# Altium schematic sheet P02_Photon.SchDoc
size 246 x 182 mm
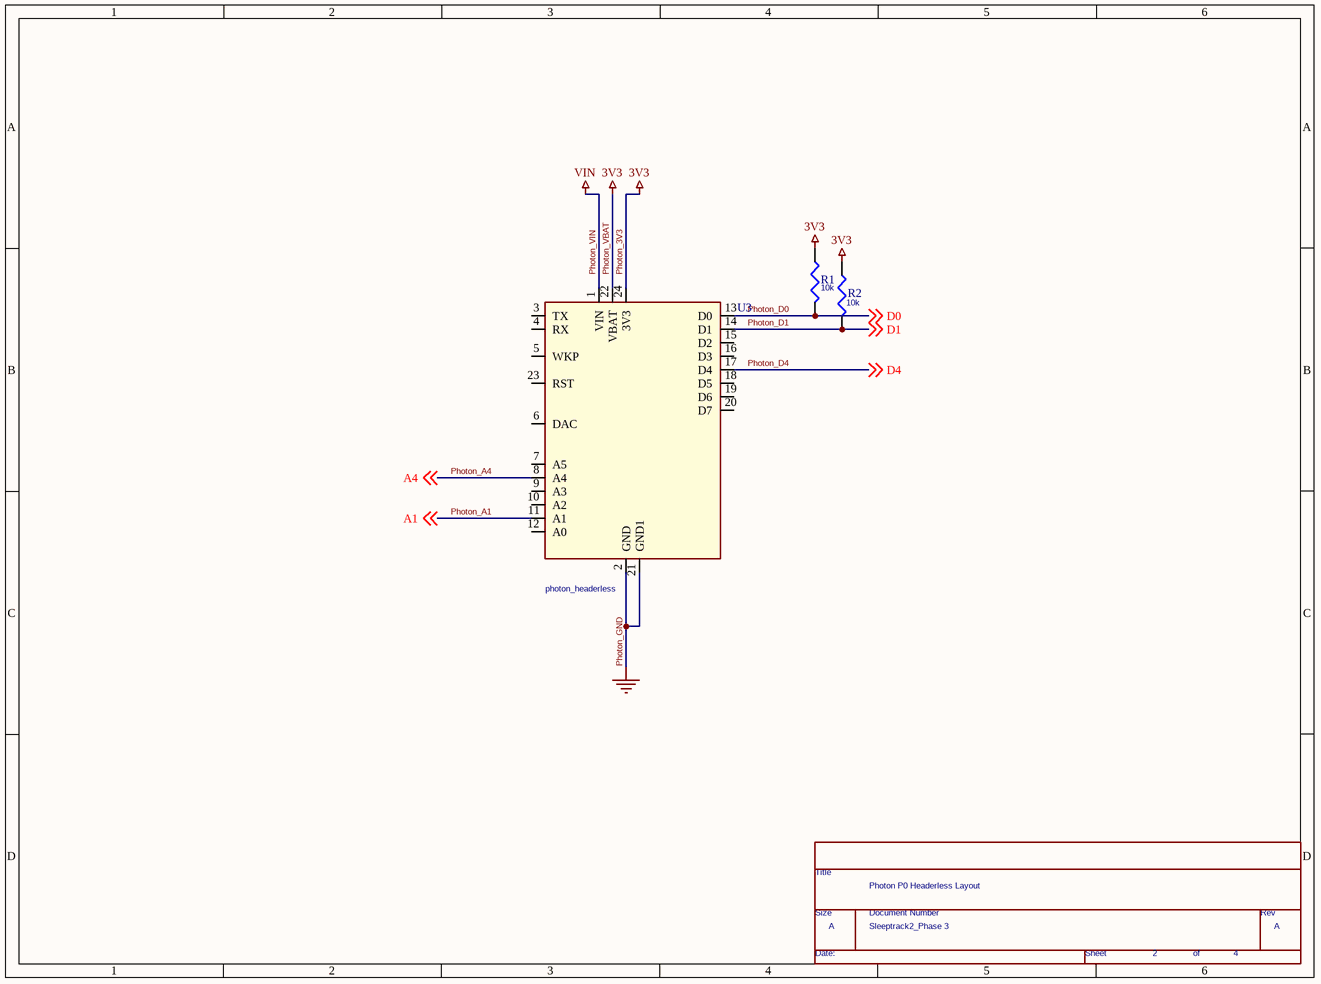
[diagram p0: P02_Photon.SchDoc]

## Parts
*  Doc: Sleeptrack2_Phase 3  RevCode: A  Title: Photon P0 Headerless Layout  Page Number: 2  Page Count: 4  (hidden comment: TitleBlock0)  (graphical)
R1  10k  [RESC402N]
R2  10k  [RESC402N]
U3  photon_headerless  [Photon P0 - duplicate]

## Nets
Photon_3V3: R1.1 R2.1 U3.22(VBAT) U3.24(3V3)  [also labelled 3V3, Photon_VBAT]
Photon_GND: U3.2(GND) U3.21(GND1)  [also labelled GND]
Photon_VIN: U3.1(VIN)  [also labelled VIN]
Photon_A1: U3.11(A1) ; off-sheet A1  [also labelled A1]
Photon_A4: U3.8(A4) ; off-sheet A4  [also labelled A4]
Photon_D0: R1.2 U3.13(D0) ; off-sheet D0  [also labelled D0]
Photon_D1: R2.2 U3.14(D1) ; off-sheet D1  [also labelled D1]
Photon_D4: U3.17(D4) ; off-sheet D4  [also labelled D4]

Not connected (* = marked no-connect by the designer): U3 3(TX) 4(RX) 5(WKP) 6(DAC) 7(A5) 9(A3) 10(A2) 12(A0) 15(D2) 16(D3) 18(D5) 19(D6) 20(D7) 23(RST)

## Notes on the sheet
- (in symbol TitleBlock0) Title; Size; Document Number; Rev; Date:; Sheet; of

## Library data of the parts
R1 R2 = RC0402FR-0710KL: RES SMD 10K OHM 1% 1/16W 0402
* = TitleBlock0: Page Create Date: March  8, 1995; Page Size: A